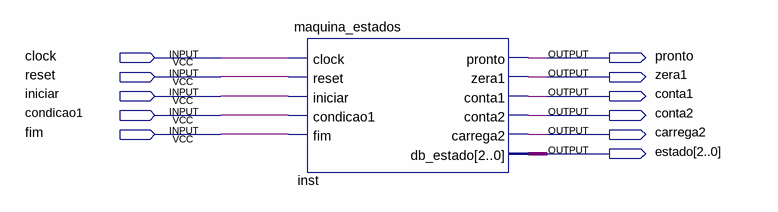
[diagram p0: schematic sheet]
// Quartus schematic montagem1.bdf as structural Verilog: 1 symbols, 11 pins
module montagem1 (
  input  clock,
  input  reset,
  input  iniciar,
  input  condicao1,
  input  fim,
  output pronto,
  output zera1,
  output conta1,
  output conta2,
  output carrega2,
  output [2:0] estado
);

  maquina_estados inst (
    .clock(clock), .reset(reset), .iniciar(iniciar), .condicao1(condicao1), .fim(fim), .pronto(pronto),
    .zera1(zera1), .conta1(conta1), .conta2(conta2), .carrega2(carrega2), .db_estado(estado));
endmodule
